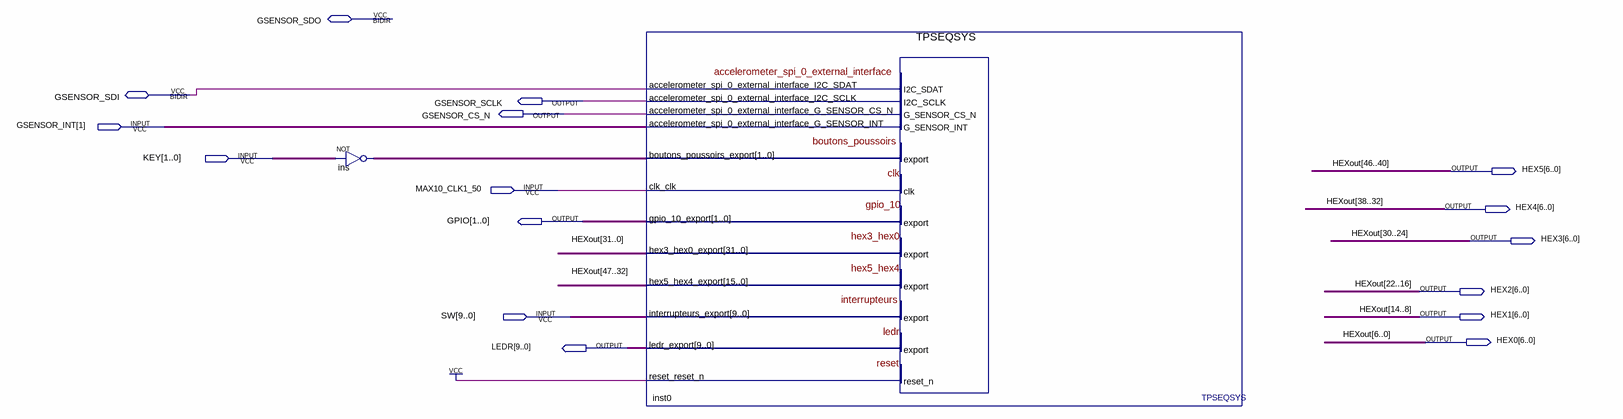
[diagram p0: schematic sheet]
// Quartus schematic TPQSYSbdf.bdf as structural Verilog: 2 symbols, 16 pins
module TPQSYSbdf (
  input  [1:1] GSENSOR_INT,
  input  [1:0] KEY,
  input  MAX10_CLK1_50,
  input  [9:0] SW,
  inout  GSENSOR_SDO,
  inout  GSENSOR_SDI,
  output GSENSOR_SCLK,
  output GSENSOR_CS_N,
  output [6:0] HEX5,
  output [6:0] HEX4,
  output [1:0] GPIO,
  output [6:0] HEX3,
  output [6:0] HEX2,
  output [6:0] HEX1,
  output [6:0] HEX0,
  output [9:0] LEDR
);

  wire [1:0] ins_out;
  wire [47:7] HEXout;

  assign ins_out = ~KEY;  // NOT ins, 2 bits wide
  TPSEQSYS inst0 (
    .accelerometer_spi_0_external_interface_G_SENSOR_INT(GSENSOR_INT[1]), .boutons_poussoirs_export(ins_out),
    .clk_clk(MAX10_CLK1_50), .interrupteurs_export(SW), .reset_reset_n(1'b1),
    .accelerometer_spi_0_external_interface_I2C_SCLK(GSENSOR_SCLK),
    .accelerometer_spi_0_external_interface_G_SENSOR_CS_N(GSENSOR_CS_N), .gpio_10_export(GPIO),
    .hex3_hex0_export({HEXout[31], HEX3, HEXout[23], HEX2, HEXout[15], HEX1, HEXout[7], HEX0}),
    .hex5_hex4_export({HEXout[47], HEX5, HEXout[39], HEX4}), .ledr_export(LEDR),
    .accelerometer_spi_0_external_interface_I2C_SDAT(GSENSOR_SDI));

  // Other names for the same wires on the sheet: HEXout (some bits) = {HEX5, HEX4, HEX3, HEX2, HEX1, HEX0}
endmodule
